# Altium schematic sheet AnalogInterface.SchDoc: Radio Interface
size A4; Engineer: CT; SheetNumber: 3; SheetTotal: 3
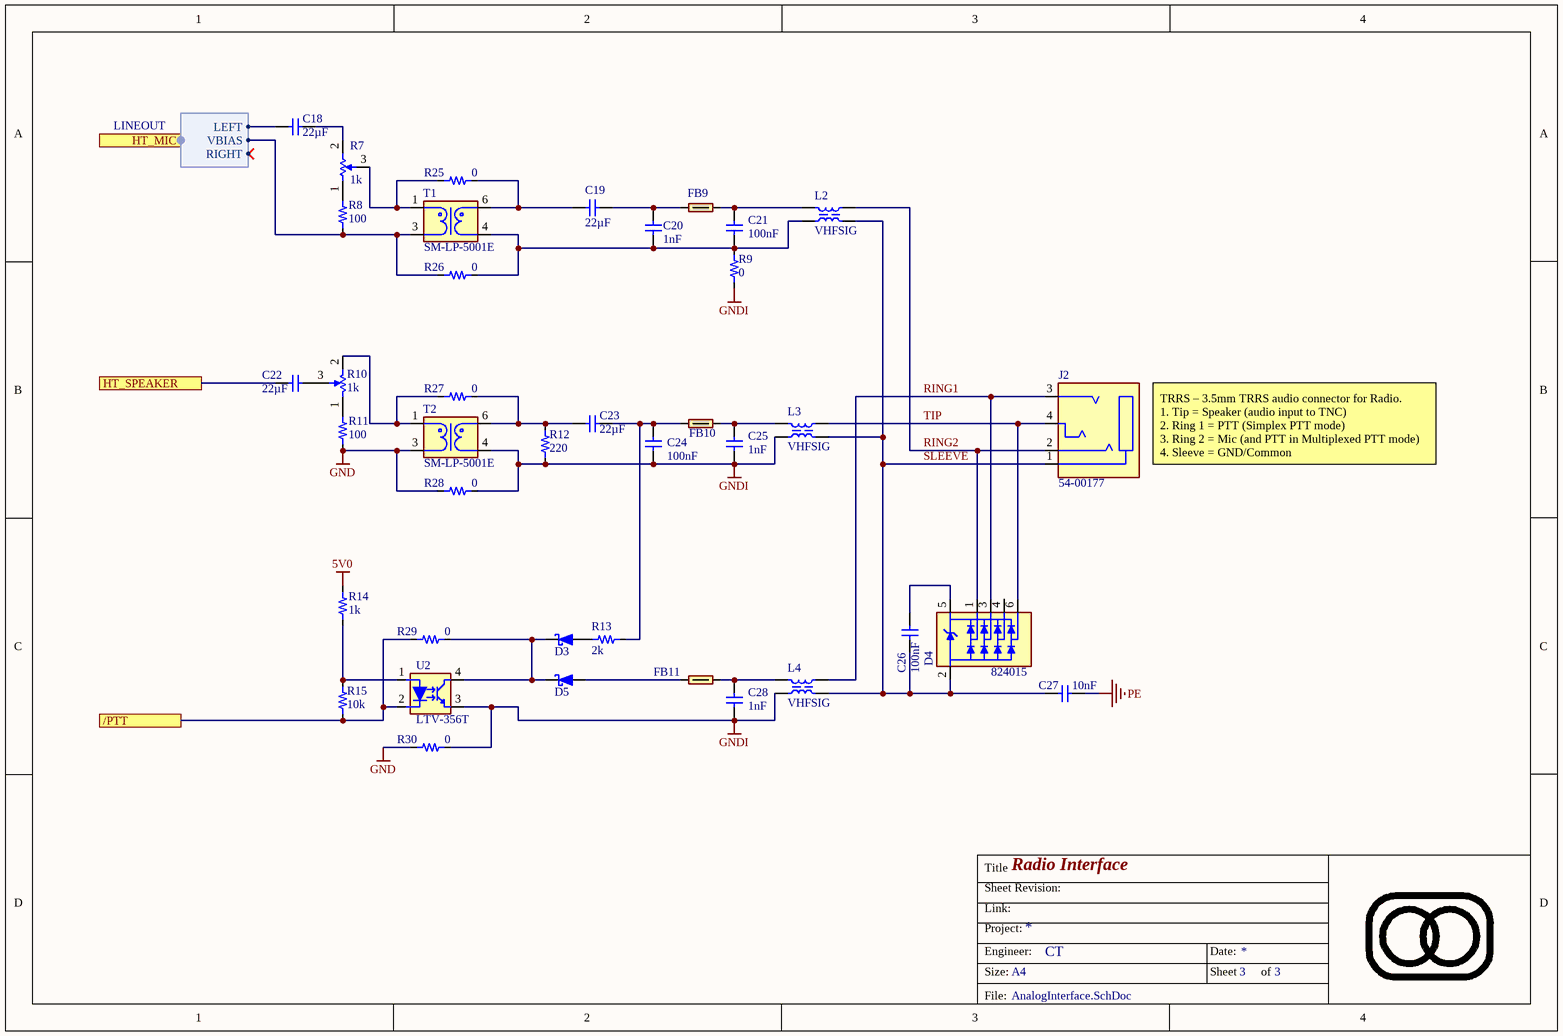
[diagram p0: AnalogInterface.SchDoc]

## Parts
C18  value 22µF  [WCAP-CSGP_1210_L3.2W2.5H2.5]  (hidden comment: Capacitor 22µF +/-10% 10V X7R 1210)
C19  value 22µF  [WCAP-CSGP_1210_L3.2W2.5H2.5]  (hidden comment: Capacitor 22µF +/-10% 10V X7R 1210)
C20  value 1nF  [0603-C-N]  (hidden comment: Capacitor 1 nF +/-5% 50V C0G 0603)
C21  value 100nF  [0603-C-N]  (hidden comment: alternative Capacitor 100nF +/-10% 50V X7R 0603)
C22  value 22µF  [WCAP-CSGP_1210_L3.2W2.5H2.5]  (hidden comment: Capacitor 22µF +/-10% 10V X7R 1210)
C23  value 22µF  [WCAP-CSGP_1210_L3.2W2.5H2.5]  (hidden comment: Capacitor 22µF +/-10% 10V X7R 1210)
C24  value 100nF  [0603-C-N]  (hidden comment: alternative Capacitor 100nF +/-10% 50V X7R 0603)
C25  value 1nF  [0603-C-N]  (hidden comment: Capacitor 1 nF +/-5% 50V C0G 0603)
C26  value 100nF  [0603-C-N]  (hidden comment: alternative Capacitor 100nF +/-10% 50V X7R 0603)
C27  value 10nF  [0603-C-N]  (hidden comment: Capacitor 10nF 50V NP0 0603)
C28  value 1nF  [0603-C-N]  (hidden comment: Capacitor 1 nF +/-5% 50V C0G 0603)
D3  RB521SM-30T2R  [FP-SOD523-MFG]  (value not drawn)
D4  824015  [SOT-23-6]
D5  RB521SM-30T2R  [FP-SOD523-MFG]  (value not drawn)
FB9  742792662  [0603-FB-N]  (value not drawn)
FB10  742792662  [0603-FB-N]  (value not drawn)
FB11  742792662  [0603-FB-N]  (value not drawn)
J2  54-00177  [54-00177-Footprint-1]
L2  value VHFSIG  [WE-CNSW_1206]  (hidden comment: 744232222)
L3  value VHFSIG  [WE-CNSW_1206]  (hidden comment: 744232222)
L4  value VHFSIG  [WE-CNSW_1206]  (hidden comment: 744232222)
R7  value 1k  [3314G-1-102E-Footprint-1]  (hidden comment: 3314G-1-102E)
R8  value 100  [0603-R-N]  (hidden comment: Resistor 100R +/-1% 50V 0603)
R9  value 0  [0603-R-N]  (hidden comment: Jumper 0R <50 mOhm 1A 0603)
R10  value 1k  [3314G-1-102E-Footprint-1]  (hidden comment: 3314G-1-102E)
R11  value 100  [0603-R-N]  (hidden comment: Resistor 100R +/-1% 50V 0603)
R12  value 220  [0603-R-N]  (hidden comment: Resistor 220R +/-1% 0.1W 0603)
R13  value 2k  [0603-R-N]  (hidden comment: Resistor 2k +/-1% 50V 0603)
R14  value 1k  [0603-R-N]  (hidden comment: Resistor 1k +/-1% 50V 0603)
R15  value 10k  [0603-R-N]  (hidden comment: Resistor 10k +/-1% 50V 0603)
R25  value 0  [0603-R-N]  (hidden comment: Jumper 0R <50 mOhm 1A 0603)
R26  value 0  [0603-R-N]  (hidden comment: Jumper 0R <50 mOhm 1A 0603)
R27  value 0  [0603-R-N]  (hidden comment: Jumper 0R <50 mOhm 1A 0603)
R28  value 0  [0603-R-N]  (hidden comment: Jumper 0R <50 mOhm 1A 0603)
R29  value 0  [0603-R-N]  (hidden comment: Jumper 0R <50 mOhm 1A 0603)
R30  value 0  [0603-R-N]  (hidden comment: Jumper 0R <50 mOhm 1A 0603)
T1  SM-LP-5001E  [FP-SM-LP-5001E-MFG]
T2  SM-LP-5001E  [FP-SM-LP-5001E-MFG]
U2  LTV-356T  [LTST-LTV-356T-4_V]

## Ports
/PTT, HT_MIC (harness LINEOUT), HT_SPEAKER

## Harnesses
LINEOUT: LEFT, VBIAS, RIGHT

## Nets
5V0: R14.1
GND: R11.2 R28.1 R30.1 T2.3
GNDI: C24.2 C25.2 C28.2 L3.2 L4.2 R9.1 R12.1 R28.2 R30.2 T2.4 U2.3(EMITTER)
PE: C27.1
/PTT: R15.1 R29.1 U2.2(CATHODE) ; port /PTT
HT_SPEAKER: C22.1 ; port HT_SPEAKER
RING1: D4.3 J2.3 L4.4
RING2: D4.1 J2.2 L2.4
SLEEVE: C26.1 C27.2 D4.2 J2.1 L2.1 L3.1 L4.1
TIP: D4.6 J2.4 L3.4
NetC18_1: C18.1 ; port HT_MIC.LEFT
NetC18_2: C18.2 R7.2(B)
NetC19_1: C19.1 C20.1 FB9.1
NetC19_2: C19.2 R25.2 T1.6
NetC20_2: C20.2 C21.2 L2.2 R9.2 R26.2 T1.4
NetC21_1: C21.1 FB9.2 L2.3
NetC22_2: C22.2 R10.3(TAP)
NetC23_1: C23.1 R12.2 R27.2 T2.6
NetC23_2: C23.2 C24.1 FB10.2 R13.2
NetC25_1: C25.1 FB10.1 L3.3
NetC26_2: C26.2 D4.5
NetC28_1: C28.1 FB11.2 L4.3
NetD3_1: D3.1(K) D5.1(K) R29.2 U2.4(COLLECTOR)
NetD3_2: D3.2(A) R13.1
NetD5_2: D5.2(A) FB11.1
NetR7_1: R7.1(A) R8.1
NetR7_3: R7.3(TAP) R25.1 T1.1
NetR8_2: R8.2 R26.1 T1.3 ; port HT_MIC.VBIAS
NetR10_1: R10.1(A) R11.1
NetR10_2: R10.2(B) R27.1 T2.1
NetR14_2: R14.2 R15.2 U2.1(ANODE)

Not connected (* = marked no-connect by the designer): D4 4

## Notes on the sheet
- TRRS – 3.5mm TRRS audio connector for Radio.
  1. Tip = Speaker (audio input to TNC)
  2. Ring 1 = PTT (Simplex PTT mode)
  3. Ring 2 = Mic (and PTT in Multiplexed PTT mode)
  4. Sleeve = GND/Common
- Title
- Sheet Revision:
- Link:
- Size:
- Project:
- Engineer:
- A4
- Date:
- Sheet
- of
- File:

## Library data of the parts
C18 C19 C22 C23 = CMP-072-000876-16: WCAP-CSGP Multilayer Ceramic Chip Capacitor, General Purpose, size 1210, X7R, 22µF, 10VDC; Page Part #: CCVK226A; Tolerance: 10%; Technical Reference: X7R1210226K010DFCT10000; Insulation Resistance: 0.02GO; Capacitor Type: MLCC; Dissipation Factor: 5%; ComponentLink2URL: https://www.we-online.com/redexpert/spec/885012209006?ad; ComponentLink1URL: https://www.we-online.com/redexpert/article/885012209006?ad; Source: WCAP-CSGP.SchLib; Case/Package: 1210; Packaging: Tape and Reel; ComponentLink1Description: Website Link; Pins: 2; Width: 2.5mm; Voltage Rating: 10V; ComponentLink2Description: Datasheet Link; Match Code: WCAP-CSGP; Max Operating Temperature: 125°C; Usage: General Purpose; JLCPCB Part #: C515687; Height: 2.5mm; Dielectric: X7R; Length: 3.2mm; Min Operating Temperature: -55°C; Design Item ID: 885012209006; Mounting Technology: SMT
C20 C25 C28 = CMP-001-00112-14: Capacitor MLCC, General Purpose, size 0603, C0G, 1 nF, +/-5%, 50V; Page Part #: CCQK102T2; Tolerance: 5%; Case/Package: 0603; Width: 0.8mm; Min Operating Temperature: -55°C; Mounting Technology: SMT; Dielectric: C0G; Packaging: Cut Tape; Max Operating Temperature: 125°C; Voltage Rating: 50V; Height: 0.8mm; Length: 1.6mm; JLCPCB Part #: C340644; REACH SVHC: Unknown; Capacitor Type: MLCC; Usage: General Purpose; Pins: 2
C21 = CMP-072-000619-17: WCAP-CSGP Multilayer Ceramic Chip Capacitor, General Purpose, size 0603, X7R, 100nF, 50VDC; Tolerance: 10%; Capacitor Type: MLCC; Dissipation Factor: 3%; Insulation Resistance: 5GO; Technical Reference: X7R0603104K050DFCT10000; Case/Package: 0603; Width: 0.8mm; Min Operating Temperature: -55°C; Mounting Technology: SMT; Dielectric: X7R; Packaging: Tape and Reel; Max Operating Temperature: 125°C; Voltage Rating: 50V; Height: 0.8mm; Length: 1.6mm; JLCPCB Part #: C14663; Usage: General Purpose; Pins: 2; ComponentLink2Description: Datasheet Link; ComponentLink2URL: https://www.we-online.com/redexpert/spec/885012206095?ad; Design Item ID: 885012206095; ComponentLink1URL: https://www.we-online.com/redexpert/article/885012206095?ad; Match Code: WCAP-CSGP; Source: WCAP-CSGP.SchLib; ComponentLink1Description: Website Link
C24 = CMP-072-000619-17: WCAP-CSGP Multilayer Ceramic Chip Capacitor, General Purpose, size 0603, X7R, 100nF, 50VDC; Tolerance: 10%; Dissipation Factor: 3%; Capacitor Type: MLCC; Insulation Resistance: 5GO; Technical Reference: X7R0603104K050DFCT10000; Case/Package: 0603; Width: 0.8mm; Min Operating Temperature: -55°C; Mounting Technology: SMT; Dielectric: X7R; Packaging: Tape and Reel; Max Operating Temperature: 125°C; Voltage Rating: 50V; Height: 0.8mm; Length: 1.6mm; JLCPCB Part #: C14663; ComponentLink2Description: Datasheet Link; ComponentLink2URL: https://www.we-online.com/redexpert/spec/885012206095?ad; Design Item ID: 885012206095; Pins: 2; ComponentLink1URL: https://www.we-online.com/redexpert/article/885012206095?ad; Match Code: WCAP-CSGP; Source: WCAP-CSGP.SchLib; Usage: General Purpose; ComponentLink1Description: Website Link
C26 = CMP-072-000619-17: WCAP-CSGP Multilayer Ceramic Chip Capacitor, General Purpose, size 0603, X7R, 100nF, 50VDC; Dissipation Factor: 3%; Tolerance: 10%; Capacitor Type: MLCC; Insulation Resistance: 5GO; Technical Reference: X7R0603104K050DFCT10000; ComponentLink2Description: Datasheet Link; Dielectric: X7R; ComponentLink2URL: https://www.we-online.com/redexpert/spec/885012206095?ad; Case/Package: 0603; Voltage Rating: 50V; Height: 0.8mm; JLCPCB Part #: C14663; Design Item ID: 885012206095; Pins: 2; Min Operating Temperature: -55°C; Max Operating Temperature: 125°C; Width: 0.8mm; ComponentLink1URL: https://www.we-online.com/redexpert/article/885012206095?ad; Match Code: WCAP-CSGP; Packaging: Tape and Reel; Source: WCAP-CSGP.SchLib; Usage: General Purpose; Length: 1.6mm; ComponentLink1Description: Website Link; Mounting Technology: SMT
C27 = CMP-001-00137-7: Multilayer Ceramic Capacitor, Grm Series, 0.01 F, 5%, C0g / Np0, 50 V, 0603 [1608 Metric]; FLIR Part #: YCAM10N-7; Page Part #: CCQJ103T; Temperature Coefficient: 30ppm/°C; Reach SVHC Compliant: No; Case/Package: 0603; Thickness: 0.035inch; Width: 0.8mm; Case Code (Metric): 1608; Termination: SMD/SMT; Min Operating Temperature: -55°C; Voltage Rating (DC): 50V; Mounting Technology: Surface Mount; Package Quantity: 4000; Depth: 0.8mm; Dielectric: C0G; Packaging: Cut Tape; Voltage: 50V; Max Operating Temperature: 125°C; RoHS Compliant: Yes; Material: Ceramic; Lead Pitch: 0.5mm; Case Code (Imperial): 0603; Tolerance: 5%; Voltage Rating: 50V; Lead Free: Lead Free; Height: 0.8mm; Length: 1.6mm; JLCPCB Part #: C85973; Series: GRM
D3 D5 = CMP-004-00062-1: RB521SM Series 30 V 200 mA Surface Mount Schottky Barrier Diode -SOD-523 (SC-79); Forward Voltage: 470mV; Forward Current: 200mA; Max Repetitive Reverse Voltage (Vrrm): 30V; Max Forward Surge Current (Ifsm): 1A; Element Configuration: Single; Number of Elements: 1; Peak Reverse Current: 30µA; JLCPCB Part #: C727120; Case/Package: SOD-523-2; Packaging: Tape & Reel; Radiation Hardening: No; Max Reverse Voltage (DC): 30V; Width: 800µm; Number of Terminals: 2; Min Operating Temperature: -40°C; Average Rectified Current: 200mA; REACH SVHC: Yes; Max Operating Temperature: 150°C; RoHS: Compliant; Pins: 2; Length: 1.2mm; Peak Non-Repetitive Surge Current: 1A; Lead Free: Lead Free; Reverse Standoff Voltage: 30V; Mounting Technology: Surface Mount; Max Output current: 200mA; Height: 600µm; Lifecycle Status: Production; Weight: 992.233309µg
D4 = CMP-034-000015-16: WE-TVS TVS Diode - High Speed Series, SOT23-6L, 4+1Channel, 5Vdc; FLIR Part #: YDITA20KV100A; Manufacturer Part Number: SP3051; Manufacturer: Wurth Elektronik; Page Part #: D824015; Reverse Channel Leakage Current: 2uA; Reverse Breakdown Voltage min.: 6.1V; Reverse Peak Pulse Current: 12A; Channel: 4+1; DC Operating Voltage: 5V; Channel Input Capacitance: 2pF; Pin Count: 6; Packaging: Tape and Reel; Source: WE-TVS.SchLib; ComponentLink1Description: Manufacturer; ComponentLink2Description: Datasheet; Mounting Technology: SMT; JLCPCB Part #: C558418; Operating Temperature: -40 to +125degC; Published Date: April 2020; Size: SOT23-6L; ComponentLink2URL: https://www.we-online.com/catalog/datasheet/824015.pdf; Design Item ID: 824015; Component Type: Standard; ComponentLink1URL: http://www.we-online.de
FB9-FB11 = CMP-066-000126-8: WE-CBF SMT EMI Suppression Ferrite Bead, size 0603, 1000O, 0.83A; Manufacturer: Wurth Elektronik; Page Part #: FILTER279; Case/Size Code: 0603; Impedance Max Test Condition: 120MHz; Type: Wide Band; DC Resistance Max: 0.3O; Impedance Max: 1050O; Rated Current: 0.6A; Mount: Surface Mount; Impedance @100MHz: 1000O; JLCPCB Part #: C180490; ComponentLink1URL: https://www.we-online.com/redexpert/article/742792662?ad; ComponentLink2URL: https://www.we-online.com/redexpert/spec/742792662?ad; Length: 1.6mm; ComponentLink1Description: Website Link; Manufacturer Part Number: 742792662; Width: 0.8mm; Match Code: WE-CBF; Component Type: Standard; Design Item ID: 742792662; Pin Count: 2; Operating Temperature Max: 125°C; Packaging: Tape and Reel; ComponentLink2Description: Datasheet Link; Operating Temperature Min: -55°C; Category: Ferrites for PCB Assembly; Height: 0.8mm
J2 = CMP-002-00136-2: Conn Jack 4 Cond 3.5MM SMD R/a; Shielding: Shielded; Body Color: Black; Gender: Female; Min Operating Temperature: -40°C; Termination: Solder; Mounting Technology: Surface Mount; JLCPCB Part #: C7507452; Max Operating Temperature: 105°C; Contact Plating: Gold; Contact Material: Bronze; Series: -
L2-L4 = CMP-061-000016-12: WE-CNSW SMT Common Mode Line Filter, size 1206, 2200Ohm@100MHz, 1-300MHz, 200mA, 1.2ohm; Page Part #: L744232222; FLIR Part #: YFIL34; Rated Voltage: 50V; Inductance: 2.578uH; Rated Current: 0.2A; Winding Style: bifiliar; Insulation Test Voltage: 125VAC; Case/Size Code: 1206; Category: Common Mode Chokes; DC Resistance Max: 1.2Ohm; Design Item ID: 744232222; Packaging: Tape and Reel; Match Code: WE-CNSW; Length: 3.2mm; ComponentLink1URL: https://www.we-online.com/redexpert/article/744232222?ad; JLCPCB Part #: C3211563; Component Type: Standard; Operating Temperature Max: 125°C; Height: 1.8mm; Source: WE-CNSW.SchLib; ComponentLink1Description: Manufacturer Link; Mount: Surface Mount; Operating Temperature Min: -40°C; Pin Count: 4; Impedance @100MHz: 2200Ohm; Width: 1.6mm; ComponentLink2URL: https://www.we-online.com/redexpert/spec/744232222?ad; ComponentLink2Description: Datasheet
R7 R10 = CMP-009-00389-2: Cermet trimmer potentiometer, 1 kΩ, 0.25 W, SMD, on top, 3314G-1-102E; Tolerance: 20%; Insulation Resistance: 100MR; Number of Turns: 1; Temperature Coefficient: 100ppm/°C; Max Power Dissipation: 250mW; Resistor Type: Cermet; Military Standard: Not; Min Operating Temperature: -55°C; Weight: 0.283g; Resistance Tolerance: 20%; RoHS Compliant: Yes; Reach SVHC Compliant: No; Length: 5mm; Packaging: Tape and Reel; JLCPCB Part #: C780221; Package Quantity: 500; Width: 4.5mm; Height: 2.55mm; Max Operating Temperature: 125°C; Depth: 6.2mm; Radiation Hardening: No; Taper: Linear; Color: Natural; Lead Free: Lead Free; Technology: CERMET; Power Rating: 250mW; Termination: Gull Wing; Mounting Technology: Surface Mount; Series: Trimpot® 3314 - Sealed
R8 R11 = CMP-009-00232-18: Chip Resistor, Thick Film, General Purpose, 0603, 63mW, 50V, 100 Ohm, +/-1%; Page Part #: ROQF1000; Temperature Coefficient: 100ppm/°C; Power Rating: 100mW; Elements: 1; Tolerance: 1%; Resistor Type: Thick Film; Usage: General Purpose; Voltage Rating: 50V; RoHS Compliant: Yes; JLCPCB Part #: C22775; Mounting Technology: SMT; Case/Package: 0603; Max Operating Temperature: 155°C; Pins: 2; Min Operating Temperature: -55°C
R9 R25-R30 = CMP-009-00006-27: Chip Jumper, Thick Film, Jumper, 0603, 100mW, 1A, 0 Ohm, <50 mOhm; FLIR Part #: YRES0E-1; Page Part #: ROQJ0000; Elements: 1; Tolerance: 50 mOhm; Voltage Rating: 75V; Min Operating Temperature: -55°C; RoHS Compliant: True; Usage: Jumper; Mounting Technology: SMT; Max Operating Temperature: 155°C; Case/Package: 0603; JLCPCB Part #: C21189; Current Rating: 1A; Resistor Type: Thick Film; Power Rating: 100mW; Pins: 2; JLCPCB Basic Part: Yes
R12 = CMP-009-00390-2: Res Thick Film 0603 220 Ohm 1% 0.1W(1/10W) ±100ppm/C Pad SMD T/R Automotive AEC-Q200; Page Part #: ROQF2200; Power Rating: 100mW; Voltage Rating: 75V; Temperature Coefficient: 100ppm/°C; Max Operating Temperature: 155°C; Packaging: Tape and Reel; Length: 0.061inch; Case/Package: 0603; Case Code (Imperial): 0603; Lead Free: Lead Free; Max Power Dissipation: 100mW; Tolerance: 1%; Min Operating Temperature: -55°C; Features: Automotive AEC-Q200; Contact Plating: Tin,Matte; Mounting Technology: Surface Mount; Height: 0.022inch; Radiation Hardening: No; Number of Terminations: 2; Width: 0.031inch; JLCPCB Part #: C22962; Case Code (Metric): 1608; Series: RMCF; RoHS Compliant: Yes
R13 = CMP-009-00298-11: Chip Resistor, Thick Film, General Purpose, 0603, 100mW, 50V, 2 kOhm, +/-1%; Elements: 1; Tolerance: 1%; Resistor Type: Thick Film; Mounting Technology: SMT; Min Operating Temperature: -55°C; Max Operating Temperature: 155°C; Case/Package: 0603; Power Rating: 100mW; JLCPCB Part #: C22975; Voltage Rating: 50V; Pins: 2; Usage: General Purpose
R14 = CMP-009-00014-30: Chip Resistor, Thick Film, General Purpose, 0603, 100mW, 50V, 1 kOhm, +/-1%; FLIR Part #: YRES1K-1; Page Part #: ROQF1001; Tolerance: 1%; Elements: 1; JLCPCB Part #: C21190; Pins: 2; Resistor Type: Thick Film; RoHS Compliant: Yes; Case/Package: 0603; Min Operating Temperature: -55°C; Power Rating: 100mW; Mounting Technology: SMT; Usage: General Purpose; Max Operating Temperature: 155°C; Voltage Rating: 50V; JLCPCB Basic Part: Yes
R15 = CMP-009-00017-29: Chip Resistor, Thick Film, General Purpose, 0603, 100mW, 50V, 10 kOhm, +/-1%; FLIR Part #: YRES10K-1; Page Part #: ROQF1002; Elements: 1; Tolerance: 1%; Pins: 2; Resistor Type: Thick Film; Voltage Rating: 50V; Power Rating: 100mW; Mounting Technology: SMT; Min Operating Temperature: -55°C; Case/Package: 0603; RoHS Compliant: Yes; Usage: General Purpose; JLCPCB Part #: C25804; Max Operating Temperature: 155°C; JLCPCB Basic part: Yes
T1 T2 = CMP-012-00012-1: Audio Transformer 1: 1 2000Vrms 115Ohm Prim. DCR 115Ohm Sec. DCR ±0.25dB 2dB Surface Mount; Return Loss: 24dB; Lead/Base Style: Gull Wing; Value: 3.8H; Operating Frequency: 0.2 to 4 kHz; Turns Ratio: 1:1; Primary Impedance: 600R; DC Resistance (DCR): 115R; Shielding: Unshielded; Isolation Voltage: 1.5kV; Height: 7.36mm; RoHS Compliant: Yes; JLCPCB Part #: C840532; Mounting Technology: Surface Mount; Termination: SMD/SMT; Depth: 14mm; Length: 12.5mm; Pins: 6; Series: SM-LP-5001; Max Operating Temperature: 85°C; Packaging: Tape and Reel; Insertion Loss: 2dB; Width: 9.6mm; Reach SVHC Compliant: No; Secondary Impedance: 600R; Package Quantity: 400; Min Operating Temperature: -20°C
U2 = CMP-00026-00001-8: LTV Series Single Channel 80 V 3750 Vrms Transistor Output Optocoupler SMT DIP-4; Page Part #: ZOCLTV356T; JLCPCB Part #: C125117